# EAGLE schematic pc_max30003_brk (EAGLE 6.6.0)
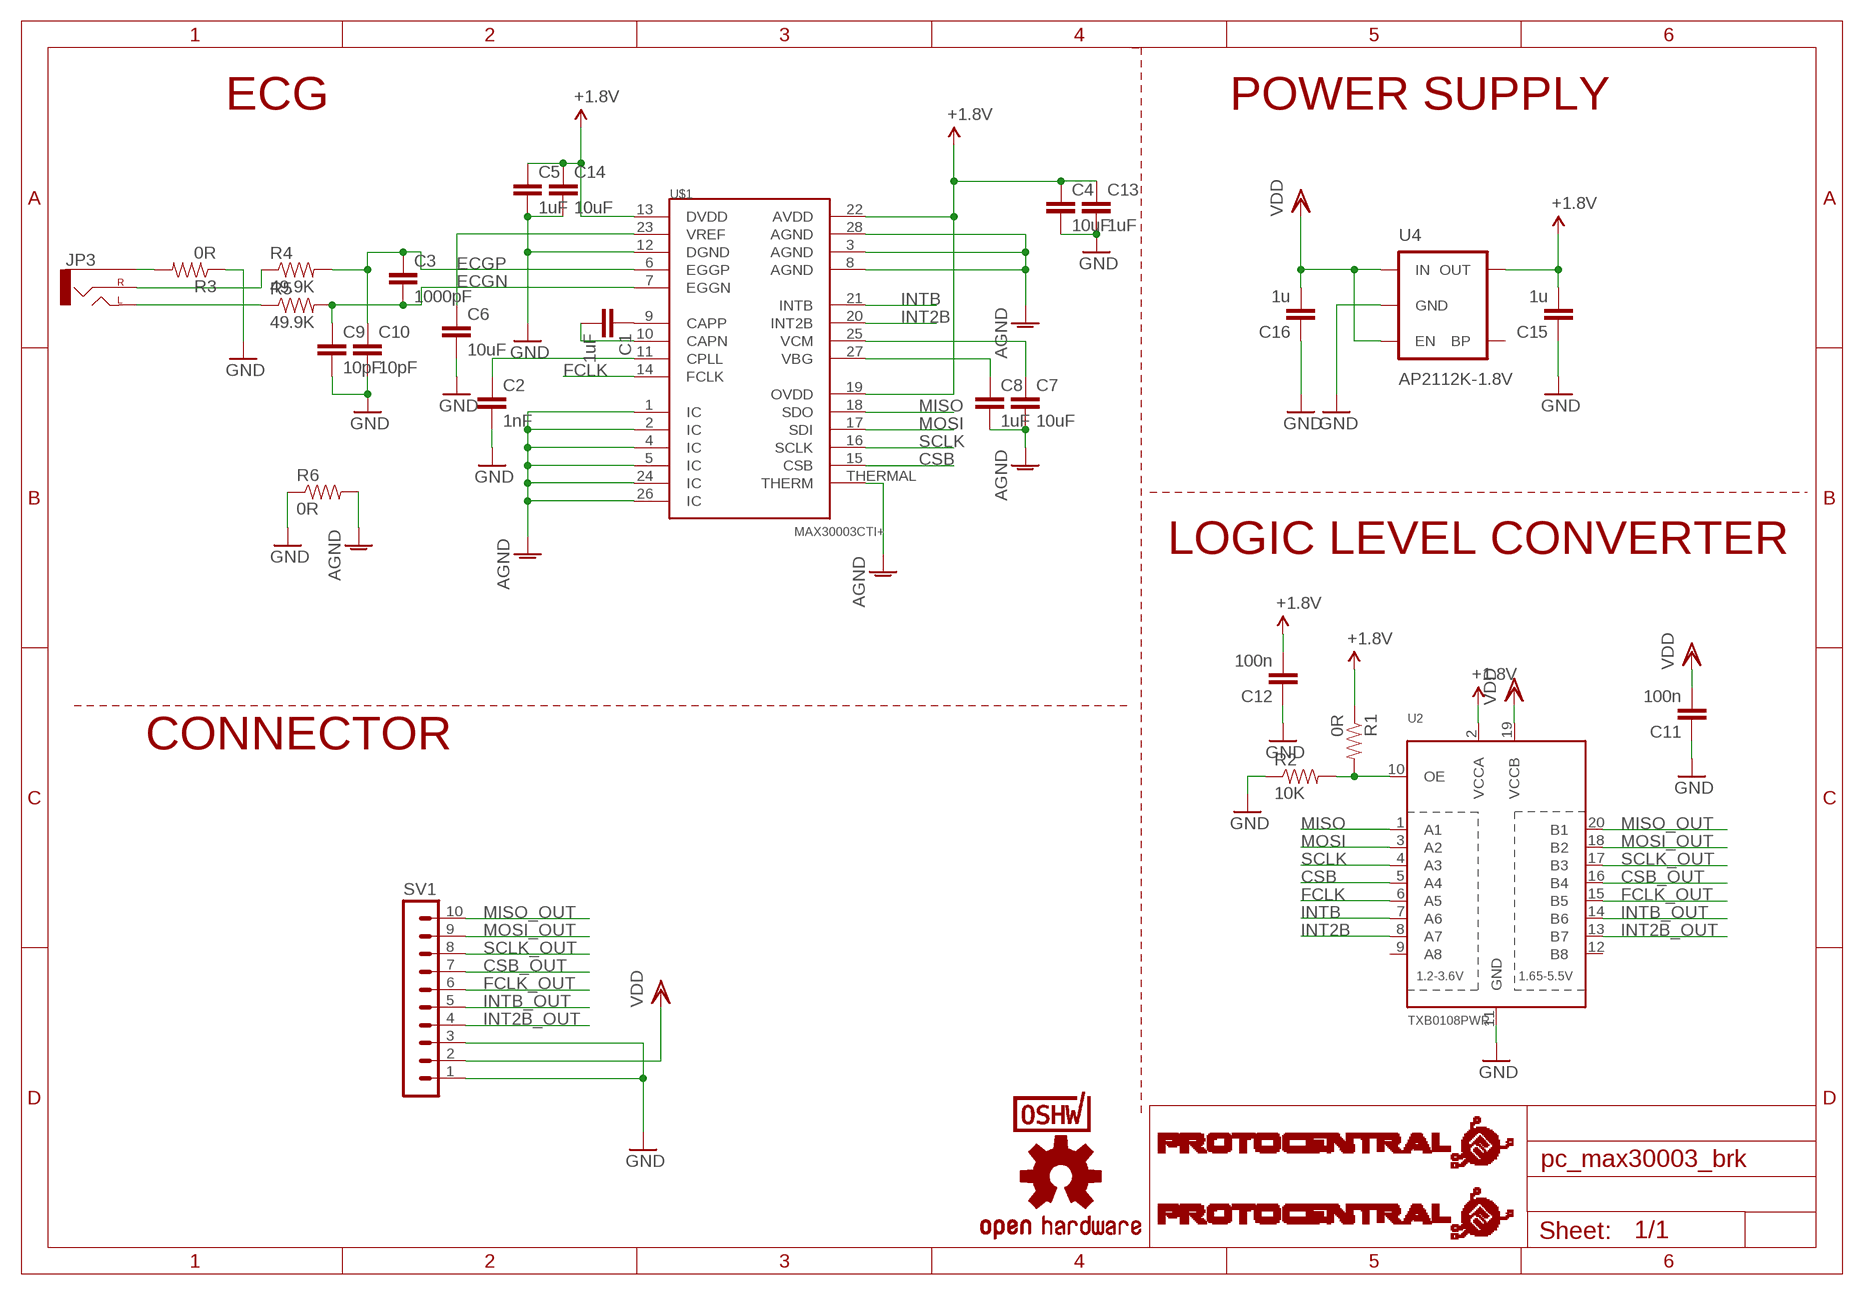
[diagram p0: schematic, sheet 1]

## Parts
C1  1uF  C-EUC0805  [C0805]
C2  1nF  C-EUC0805  [C0805]
C3  1000pF  C-EUC0402  [C0402]
C4  10uF  C-EUC0805  [C0805]
C5  1uF  C-EUC0805  [C0805]
C6  10uF  C-EUC0805  [C0805]
C7  10uF  C-EUC0805  [C0805]
C8  1uF  C-EUC0805  [C0805]
C9  10pF  C-EUC0402  [C0402]
C10  10pF  C-EUC0402  [C0402]
C11  100n  C-EUC0402  [C0402]
C12  100n  C-EUC0402  [C0402]
C13  1uF  C-EUC0805  [C0805]
C14  10uF  C-EUC0805  [C0805]
C15  1u  C-EUC0805  [C0805]
C16  1u  C-EUC0805  [C0805]
JP3  AUDIO-JACKSMD2  [AUDIO-JACK-3.5MM-SMD]
R1  0R  RESISTOR0805-RES  [0805]
R2  10K  RESISTOR0805-RES  [0805]
R3  0R  RESISTOR0805-RES  [0805]
R4  49.9K  RESISTOR0805-RES  [0805]
R5  49.9K  RESISTOR0805-RES  [0805]
R6  0R  RESISTOR0805-RES  [0805]
SV1  MA10-1  [MA10-1]
U2  TXB0108PWR  [TSSOP20]
U4  AP2112K-1.8V  V_REG_LDOSMD  [SOT23-5]
U$1  MAX30003CTI+  MAX30003  [QFN-28]
U$2  PROTY_LOGO_WITH_TEXT  [PROTY_WITH_TEXT]
U$3  PROTY-LOGO  [LOGO-PROTY]
U$6  OSHW-LOGOS  [OSHW-LOGO-S]
U$7  CERT-SMALL  [CERT-SMALL-SILK]

## Nets
+1.8V: C4.1 C5.1 C12.2 C13.1 C14.1 C15.2 R1.1 U2.2(VCCA) U4.5(OUT) U$1.13(DVDD) U$1.19(OVDD) U$1.22(AVDD)
AGND: C7.2 C8.2 R6.2 U$1.1(IC) U$1.2(IC) U$1.3(AGND) U$1.4(IC) U$1.5(IC) U$1.8(AGND) U$1.24(IC) U$1.26(IC) U$1.28(AGND) U$1.THERMAL(THERM)
CSB: U2.5(A4) U$1.15(CSB)
CSB_OUT: SV1.7 U2.16(B4)
ECGN: C3.2 C9.1 R5.2 U$1.7(EGGN)
ECGP: C3.1 C10.1 R4.2 U$1.6(EGGP)
FCLK: U2.6(A5) U$1.14(FCLK)
FCLK_OUT: SV1.6 U2.15(B5)
GND: C2.2 C4.2 C5.2 C6.2 C9.2 C10.2 C11.1 C12.1 C13.2 C14.2 C15.1 C16.1 R2.1 R3.1 R6.1 SV1.1 SV1.3 U2.11(GND) U4.2(GND) U$1.12(DGND)
INT2B: U2.8(A7) U$1.20(INT2B)
INT2B_OUT: SV1.4 U2.13(B7)
INTB: U2.7(A6) U$1.21(INTB)
INTB_OUT: SV1.5 U2.14(B6)
MISO: U2.1(A1) U$1.18(SDO)
MISO_OUT: SV1.10 U2.20(B1)
MOSI: U2.3(A2) U$1.17(SDI)
MOSI_OUT: SV1.9 U2.18(B2)
N$1: R1.2 R2.2 U2.10(OE)
N$2: C6.1 U$1.23(VREF)
N$3: C1.1 U$1.9(CAPP)
N$4: JP3.SLEEVE R3.2
N$6: C1.2 U$1.10(CAPN)
N$7: C2.1 U$1.11(CPLL)
N$9: JP3.TIP(LEFT) R5.1
N$10: JP3.RING(RIGHT) R4.1
N$13: C7.1 U$1.25(VCM)
N$14: C8.1 U$1.27(VBG)
SCLK: U2.4(A3) U$1.16(SCLK)
SCLK_OUT: SV1.8 U2.17(B3)
VDD: C11.2 C16.2 SV1.2 U2.19(VCCB) U4.1(IN) U4.3(EN)
Unconnected: U2.9(A8) U2.12(B8) U4.4(BP)

## Notes on the sheet
- ECG | POWER SUPPLY
- LOGIC LEVEL CONVERTER
- CONNECTOR

## Library data of the parts
C1-C16 = rcl:C-EU: CAPACITOR, European symbol
JP3 = SparkFun-Connectors:AUDIO-JACK: 3.5mm Audio Jack Simple 3.5mm common PCB mount audio jack. SKU: PRT-08032; PROD_ID: CONN-10353
R1-R6 = SparkFun:RESISTOR: Resistor Basic schematic elements and footprints for 0603, 1206, and PTH resistors.
SV1 = con-lstb:MA10-1: PIN HEADER; OC_FARNELL: unknown; OC_NEWARK: unknown
U2 = adafruit:TXB0108PWR: 8-Bit Bi-Directional Level Shifter 1.2V-3.6V (VCCA) to 1.65V-5.5V (VCCB) bi-directional level shifter with auto direction sensing. Max data rate - VCCA 1.8V: 20Mbps (50ns), VCCA 3.3V: 100Mbps (10ns) Digikey: 296-21527-1-ND
U4 = SparkFun-PowerIC:V_REG_LDO: Voltage Regulator LDO Standard 150mA LDO voltage regulator in SOT-23 layout. Micrel part MIC5205. BP (by-pass) pin is used to lower output noise with 470pF cap.; PROD_ID: VREG-12457
U$1 = circuitects:MAX30003
U$2 = circuitects:PROTY_LOGO_WITH_TEXT
U$3 = circuitects:PROTY-LOGO
U$6 = SparkFun:OSHW-LOGO: Open Source Hardware Logo This logo indicates the piece of hardware it is found on incorporates a OSHW license and/or adheres to the definition of open source hardware found here: http://freedomdefined.org/OSHW
U$7 = OSHWA:CERT